# Altium schematic sheet BLUETOOTH_nRF52382.SchDoc
size 393 x 281 mm; SheetNumber: 4; SheetTotal: 6
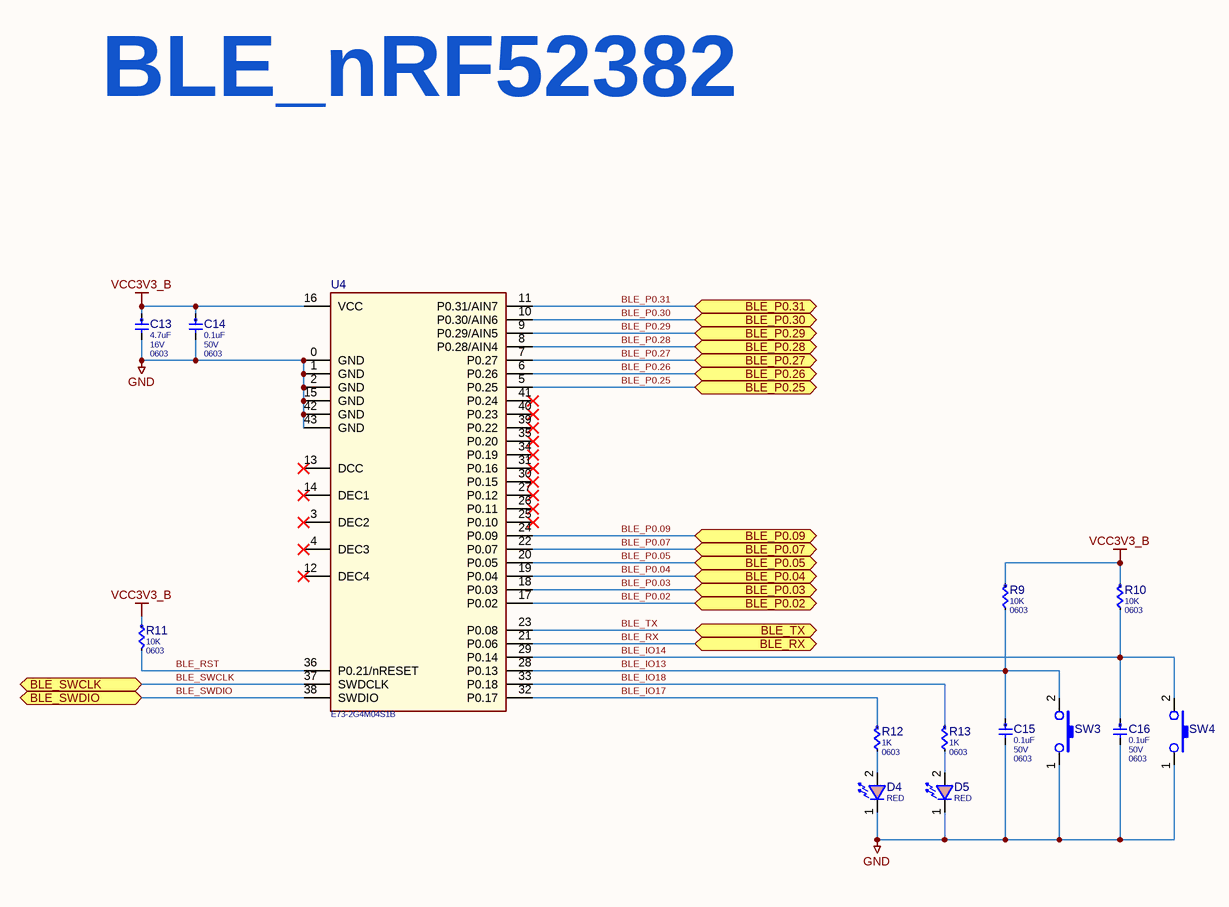
[diagram p0: BLUETOOTH_nRF52382.SchDoc]

## Parts
C13  value 4.7uF  VOLTAGE: 16V  PACK: 0603  [C0603]  (hidden comment: 4.7uF 16V 0603)
C14  value 0.1uF  VOLTAGE: 50V  PACK: 0603  [C0603]  (hidden comment: 0.1uF 50V 0603)
C15  value 0.1uF  VOLTAGE: 50V  PACK: 0603  [C0603]  (hidden comment: 0.1uF 50V 0603)
C16  value 0.1uF  VOLTAGE: 50V  PACK: 0603  [C0603]  (hidden comment: 0.1uF 50V 0603)
D4  COLOR: RED  [LED0805_RED]  (hidden comment: LH R974-LP-1)
D5  COLOR: RED  [LED0805_RED]  (hidden comment: LH R974-LP-1)
R9  value 10K  PACK: 0603  [R0603]  (hidden comment: 10K 0603)
R10  value 10K  PACK: 0603  [R0603]  (hidden comment: 10K 0603)
R11  value 10K  PACK: 0603  [R0603]  (hidden comment: 10K 0603)
R12  value 1K  PACK: 0603  [R0603]  (hidden comment: 1K 0603)
R13  value 1K  PACK: 0603  [R0603]  (hidden comment: 1K 0603)
SW3  BTN 3x6x5 SMD  [BTN_6L3W5H]  (value not drawn)
SW4  BTN 3x6x5 SMD  [BTN_6L3W5H]  (value not drawn)
U4  nRF52832  [E73-2G4M04S1B]  (value not drawn)

## Ports
BLE_P0.02 (bidir), BLE_P0.03 (bidir), BLE_P0.04 (bidir), BLE_P0.05 (bidir), BLE_P0.07 (bidir), BLE_P0.09 (bidir), BLE_P0.25 (bidir), BLE_P0.26 (bidir), BLE_P0.27 (bidir), BLE_P0.28 (bidir), BLE_P0.29 (bidir), BLE_P0.30 (bidir), BLE_P0.31 (bidir), BLE_RX (bidir), BLE_SWCLK (bidir), BLE_SWDIO (bidir), BLE_TX (bidir)

## Nets
GND: C13.2 C14.2 C15.2 C16.2 D4.1(K) D5.1(K) SW3.1(1,2) SW4.1(1,2) U4.0(GND) U4.1(GND) U4.2(GND) U4.15(GND) U4.42(GND) U4.43(GND)
VCC3V3_B: C13.1 C14.1 R9.1 R10.1 R11.1 U4.16(VCC)
BLE_IO13: C15.1 R9.2 SW3.2(3,4) U4.28(P0.13)
BLE_IO14: C16.1 R10.2 SW4.2(3,4) U4.29(P0.14)
BLE_IO17: R12.1 U4.32(P0.17)
BLE_IO18: R13.1 U4.33(P0.18)
BLE_P0.02: U4.17(P0.02) ; port BLE_P0.02
BLE_P0.03: U4.18(P0.03) ; port BLE_P0.03
BLE_P0.04: U4.19(P0.04) ; port BLE_P0.04
BLE_P0.05: U4.20(P0.05) ; port BLE_P0.05
BLE_P0.07: U4.22(P0.07) ; port BLE_P0.07
BLE_P0.09: U4.24(P0.09) ; port BLE_P0.09
BLE_P0.25: U4.5(P0.25) ; port BLE_P0.25
BLE_P0.26: U4.6(P0.26) ; port BLE_P0.26
BLE_P0.27: U4.7(P0.27) ; port BLE_P0.27
BLE_P0.28: U4.8(P0.28/AIN4) ; port BLE_P0.28
BLE_P0.29: U4.9(P0.29/AIN5) ; port BLE_P0.29
BLE_P0.30: U4.10(P0.30/AIN6) ; port BLE_P0.30
BLE_P0.31: U4.11(P0.31/AIN7) ; port BLE_P0.31
BLE_RST: R11.2 U4.36(P0.21/nRESET)
BLE_RX: U4.21(P0.06) ; port BLE_RX
BLE_SWCLK: U4.37(SWDCLK) ; port BLE_SWCLK
BLE_SWDIO: U4.38(SWDIO) ; port BLE_SWDIO
BLE_TX: U4.23(P0.08) ; port BLE_TX
NetD4_2: D4.2(A) R12.2
NetD5_2: D5.2(A) R13.2

Not connected (* = marked no-connect by the designer): U4 3(DEC2)* 4(DEC3)* 12(DEC4)* 13(DCC)* 14(DEC1)* 25(P0.10)* 26(P0.11)* 27(P0.12)* 30(P0.15)* 31(P0.16)* 34(P0.19)* 35(P0.20)* 39(P0.22)* 40(P0.23)* 41(P0.24)*

## Notes on the sheet
- BLE_nRF52382
- Title:
- Size:
- A3
- Date Modified:
- Document Number:
- Rev:
- Engineer:
- Sheet
- Of

## Library data of the parts
C13 = C0603_4.7uF_16V_20%: CAP CER 4.7UF 20% 16V X5R 0603 SMD; MGR: Murata Electronics; MGR PN: GRM188R61C475ME11D; Group: CAP CER; Line Type: SMT; Unit: PCS; TYPE: CAP; Mounting Type: SMD; PHX PN: *; PHX CODE: *; NOTE: *; SAP code: *; Part Code: *; Part Type: EP; TEMP: X5R; TOLERANCE: 20%
C14-C16 = C0603_0.1uF_50V_10%: CAP CER 0.1UF 10% 50V X7R 0603 SMD; MGR: Murata Electronics; MGR PN: GCM188R71H104KA57D; Group: CAP CER; Line Type: SMT; Unit: PCS; TYPE: CAP; Mounting Type: SMD; PHX PN: *; PHX CODE: *; NOTE: *; SAP code: *; Part Code: *; Part Type: EP; TEMP: X7R; TOLERANCE: 10%
D4 D5 = LED0805_RED: LED IND RED 1.8V 20mA 0805 SMD; MGR: OSRAM; Group: LED IND; Line Type: SMT; Unit: PCS; PACK: 0805; TYPE: LED; Mounting Type: SMD; PHX PN: *; PHX CODE: *; NOTE: *; SAP code: *; Part Code: *; Part Type: EP; VF(V): 1.8V; IF(mA): 20mA; MGR PN: LH R974-LP-1
R9-R11 = R0603_10K_1/10W_1%: RES CHP 10K 1% 1/10W 0603 SMD; MGR: PANASONIC; MGR PN: ERJ-3EKF1002V; Group: RES CHP; Line Type: SMT; Unit: PCS; TYPE: RES; Mounting Type: SMD; PHX PN: *; PHX CODE: *; NOTE: *; SAP code: *; Part Code: *; Part Type: EP; POWER: 1/10W; TOLERANCE: 1%
R12 R13 = R0603_1K_1/10W_1%: RES CHP 1K 1% 1/10W 0603 SMD; MGR: PANASONIC; MGR PN: ERJ-3EKF1001V; Group: RES CHP; Line Type: SMT; Unit: PCS; TYPE: RES; Mounting Type: SMD; PHX PN: *; PHX CODE: *; NOTE: *; SAP code: *; Part Code: *; Part Type: EP; POWER: 1/10W; TOLERANCE: 1%
SW3 SW4 = SWT_BTN_3x6x5: SWT BTN 3x6x5 SMD; MGR: BANLINHKIEN; Group: SWT BTN; Line Type: SMT; PACK: 6L3W5H; Unit: PCS; TYPE: SWT; Mounting Type: SMD; PHX PN: *; PHX CODE: *; NOTE: *; SAP code: *; Part Code: *; Part Type: EP; MGR PN: BTN 3x6x5 SMD
U4 = MDL_nRF52832: MDL RF TRX BLE4.2 E73-2G4M04S1B 28.7L17.5W2.6H SMD; MGR: EBYTE; Group: MDL  RF; Line Type: SMT; Unit: PCS; VOLTAGE: 1.8V ~ 3.6V; TYPE: MDL; PACK: 28.7L17.5W2.6H; Mounting Type: SMD; PHX PN: *; PHX CODE: *; NOTE: *; SAP code: *; Part Code: *; Part Type: EP; CURRENT: *; MGR PN: E73-2G4M04S1B